# EAGLE design Line Camera Rev. A (EAGLE 9.4.0)

## Sheet 1 of 2
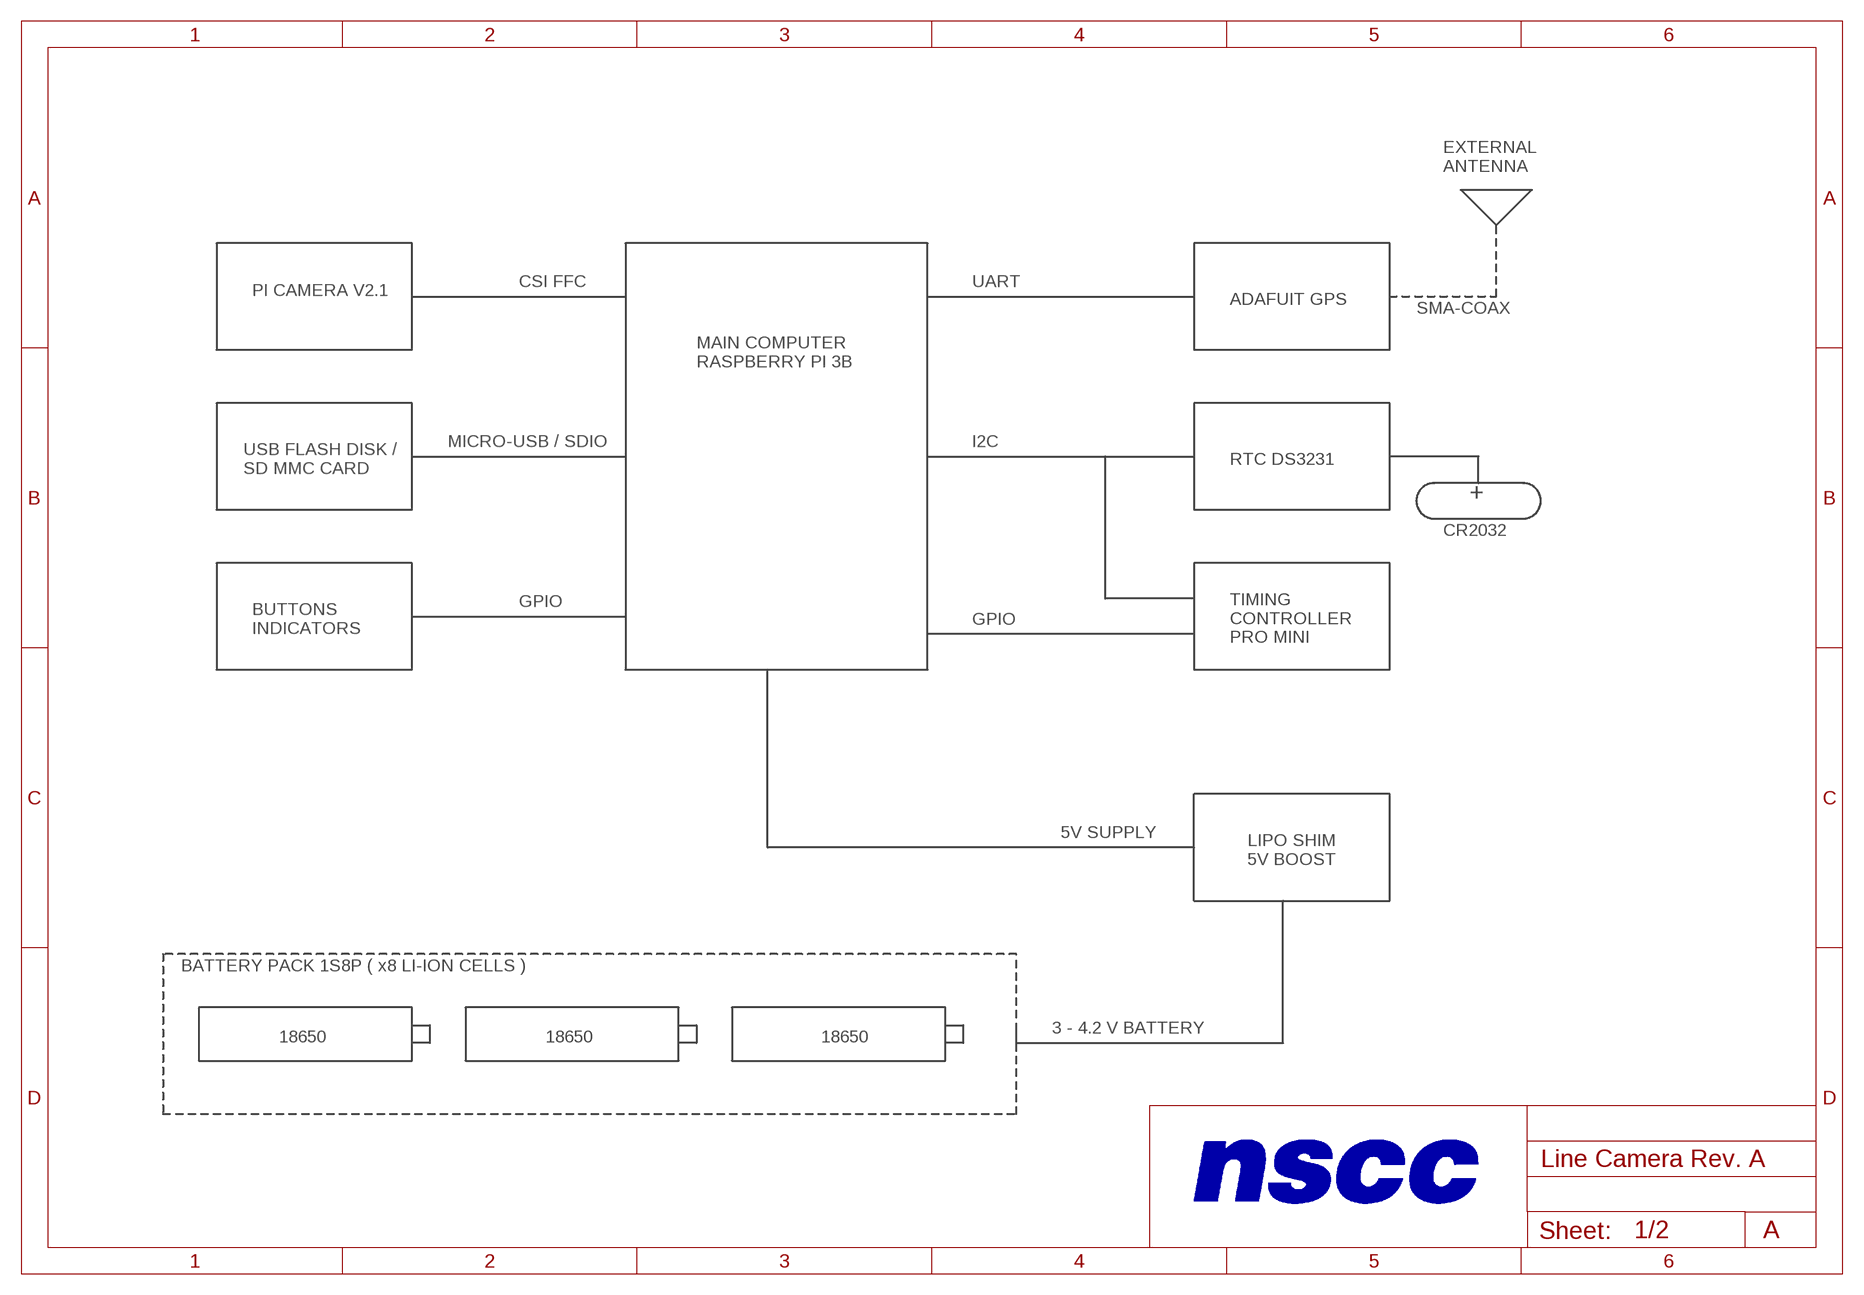
[diagram p0: schematic, sheet 1]

### Notes on the sheet
- EXTERNAL 
  ANTENNA
- CSI FFC | UART
- PI CAMERA V2.1
- ADAFUIT GPS
- SMA-COAX
- MAIN COMPUTER
  RASPBERRY PI 3B
- MICRO-USB / SDIO | I2C
- RTC DS3231
- USB FLASH DISK /
  SD MMC CARD
- +
- CR2032
- GPIO
- GPIO
- BUTTONS
  INDICATORS
- TIMING 
  CONTROLLER
  PRO MINI
- 5V SUPPLY
- LIPO SHIM
  5V BOOST
- BATTERY PACK 1S8P ( x8 LI-ION CELLS )
- 3 - 4.2 V BATTERY
- 18650 | 18650 | 18650
- A

## Sheet 2 of 2
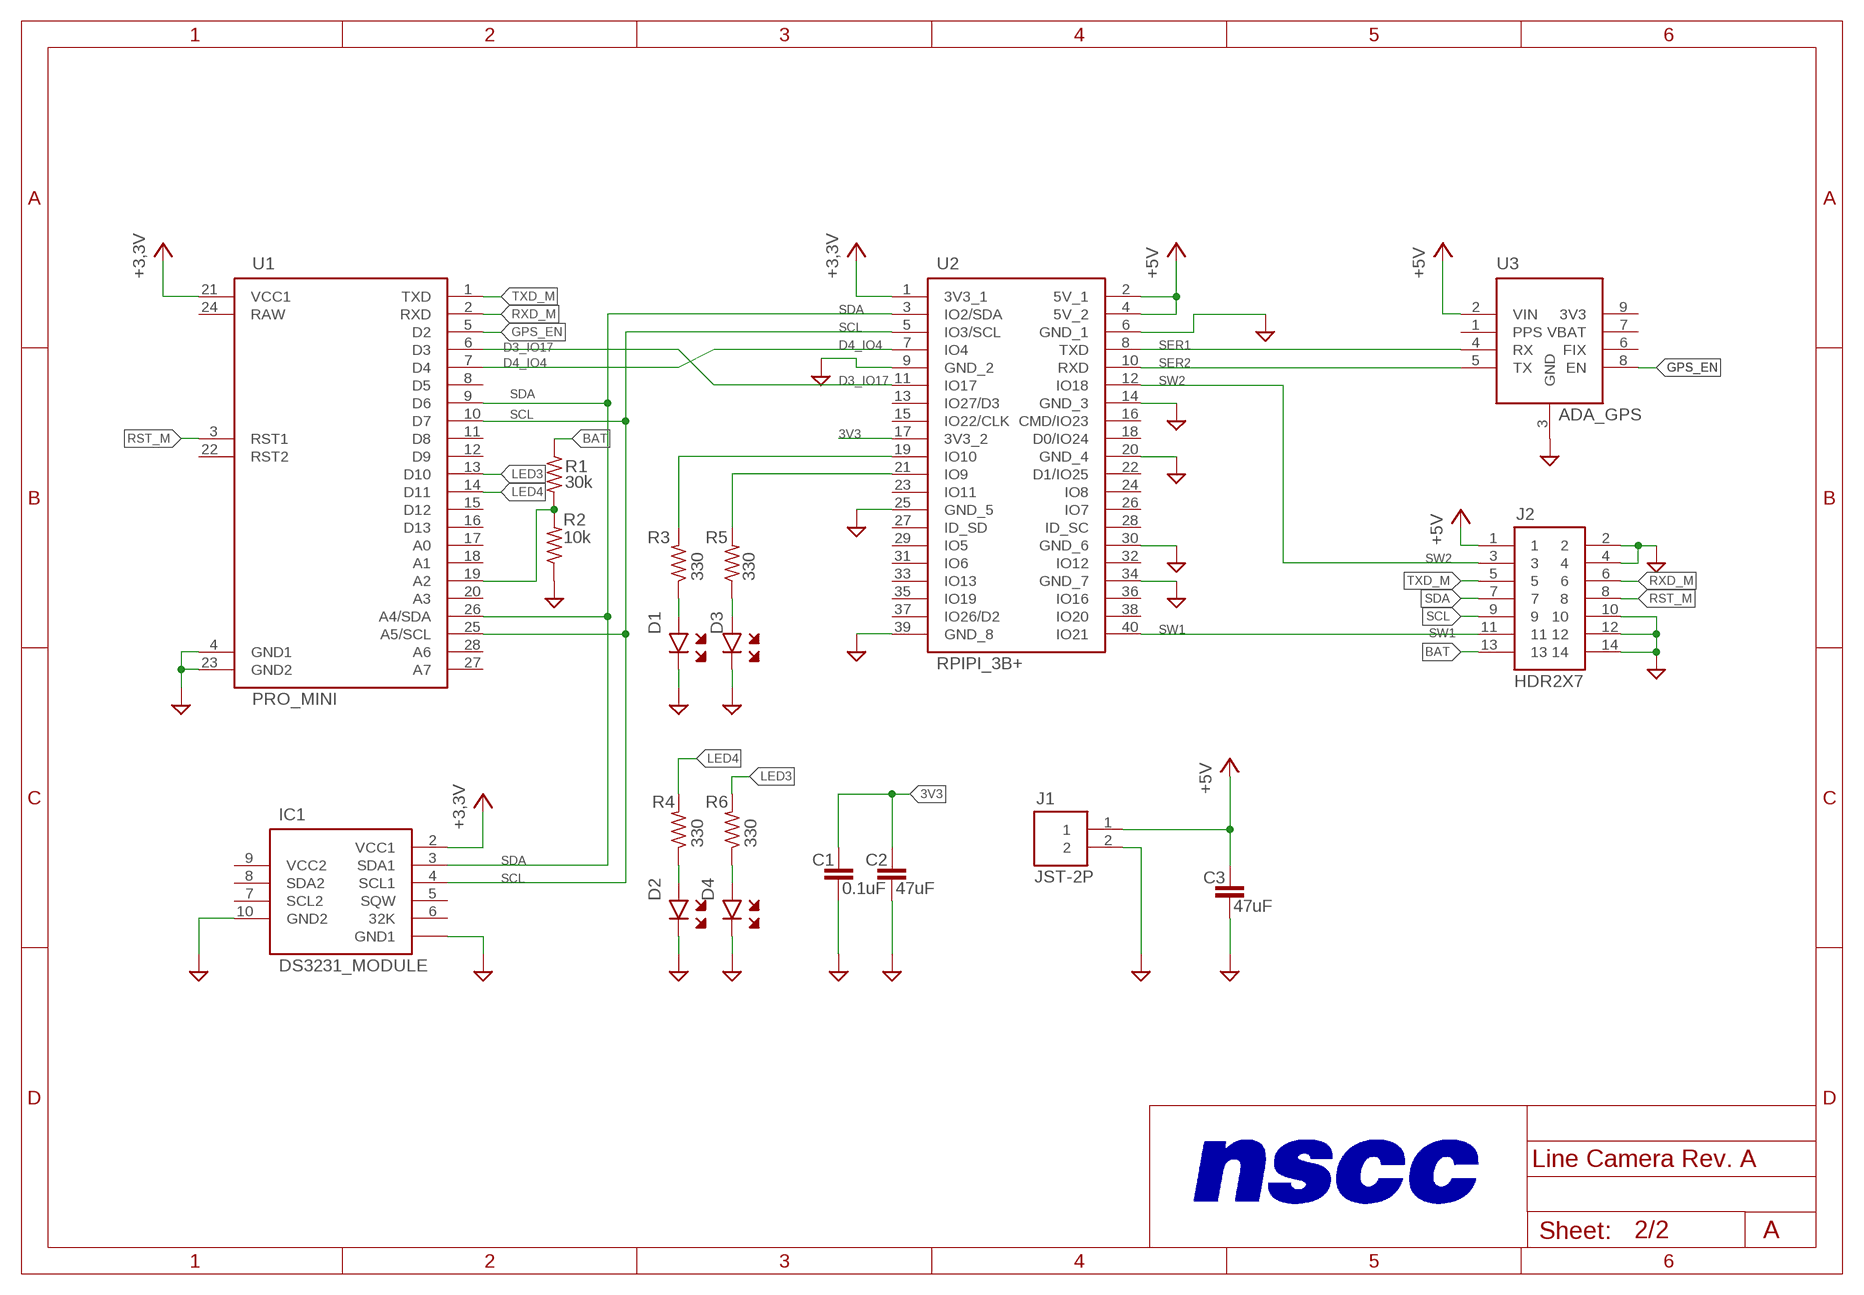
[diagram p1: schematic, sheet 2]

### Parts
C1  0.1uF  CAP_THCAP-TH-2MM  [CAPPRD254W65D300H300B]
C2  47uF  CAP_THCAP-ELECTRO-5.08  [CAPPRD508W65D1000H1100B]
C3  47uF  CAP_THCAP-ELECTRO-5.08  [CAPPRD508W65D1000H1100B]
D1  LED_THLED-2.54  [LEDRD254W60D565H860B]
D2  LED_THLED-2.54  [LEDRD254W60D565H860B]
D3  LED_THLED-2.54  [LEDRD254W60D565H860B]
D4  LED_THLED-2.54  [LEDRD254W60D565H860B]
IC1  DS3231_MODULE  [DS3231_MODULE]
J1  JST-2P  HDR1X22P2.54MM  [HDR1X2]
J2  HDR2X7  HDR2X7HDR2X7  [HDR2X7]
R1  30k  RES_THRES-D8.5  [RESAD1176W63L850D250B]
R2  10k  RES_THRES-D8.5  [RESAD1176W63L850D250B]
R3  330  RES_THRES-D8.5  [RESAD1176W63L850D250B]
R4  330  RES_THRES-D8.5  [RESAD1176W63L850D250B]
R5  330  RES_THRES-D8.5  [RESAD1176W63L850D250B]
R6  330  RES_THRES-D8.5  [RESAD1176W63L850D250B]
U1  PRO_MINI  [PRO_MINI]
U2  RPIPI_3B+  [PI_3B]
U3  ADA_GPS  ADA_ULTIMATE_GPS9P_BREAKOUT  [ADA_ULTIMATE_GPS]

### Nets
3V3: C1.1 C2.1 U2.17(3V3_2)
+3,3V: IC1.2(VCC1) U1.21(VCC1) U2.1(3V3_1)
+5V: C3.1 J1.1 J2.1 U2.2(5V_1) U2.4(5V_2) U3.2(VIN)
BAT: J2.13 R1.1
BAT_IN: R1.2 R2.2 U1.19(A2)
D3_IO17: U1.6(D3) U2.11(IO17)
D4_IO4: U1.7(D4) U2.7(IO4)
GND: C1.2 C2.2 C3.2 D1.2 D2.2 D3.2 D4.2 IC1.1(GND1) IC1.10(GND2) J1.2 J2.2 J2.4 J2.10 J2.12 J2.14 R2.1 U1.4(GND1) U1.23(GND2) U2.6(GND_1) U2.9(GND_2) U2.14(GND_3) U2.20(GND_4) U2.25(GND_5) U2.30(GND_6) U2.34(GND_7) U2.39(GND_8) U3.3(GND)
GPS_EN: U1.5(D2) U3.8(EN)
LED1: R3.2 U2.19(IO10)
LED2: R5.2 U2.21(IO9)
LED3: R6.2 U1.13(D10)
LED4: R4.2 U1.14(D11)
N$1: D4.1 R6.1
N$10: D1.1 R3.1
N$11: D3.1 R5.1
N$15: D2.1 R4.1
RST_M: J2.8 U1.3(RST1)
RXD_M: J2.6 U1.2(RXD)
SCL: IC1.4(SCL1) J2.9 U1.10(D7) U1.25(A5/SCL) U2.5(IO3/SCL)
SDA: IC1.3(SDA1) J2.7 U1.9(D6) U1.26(A4/SDA) U2.3(IO2/SDA)
SER1: U2.8(TXD) U3.4(RX)
SER2: U2.10(RXD) U3.5(TX)
SW1: J2.11 U2.40(IO21)
SW2: J2.3 U2.12(IO18)
TXD_M: J2.5 U1.1(TXD)
Unconnected: IC1.5(SQW) IC1.6(32K) IC1.7(SCL2) IC1.8(SDA2) IC1.9(VCC2) U1.8(D5) U1.11(D8) U1.12(D9) U1.15(D12) U1.16(D13) U1.17(A0) U1.18(A1) U1.20(A3) U1.22(RST2) U1.24(RAW) U1.27(A7) U1.28(A6) U2.13(IO27/D3) U2.15(IO22/CLK) U2.16(CMD/IO23) U2.18(D0/IO24) U2.22(D1/IO25) U2.23(IO11) U2.24(IO8) U2.26(IO7) U2.27(ID_SD) U2.28(ID_SC) U2.29(IO5) U2.31(IO6) U2.32(IO12) U2.33(IO13) U2.35(IO19) U2.36(IO16) U2.37(IO26/D2) U2.38(IO20) U3.1(PPS) U3.6(FIX) U3.7(VBAT) U3.9(3V3)

### Notes on the sheet
- A

## Library data of the parts
C1-C3 = Underwater-Camera-v2.0:CAP_TH: Capacitor Electro. TH
D1-D4 = Underwater-Camera-v2.0:LED_TH: TH LED - large
IC1 = Underwater-Camera-v2.0:DS3231_MODULE: DS3231 RTC Breakout Module
J1 = Underwater-Camera-v2.0:HDR1X2: Header 2pin 2.54mm pitch
J2 = Underwater-Camera-v2.0:HDR2X7
R1-R6 = Underwater-Camera-v2.0:RES_TH: Resistor TH
U1 = Underwater-Camera-v2.0:PRO_MINI: Arduino Pro Mini from SparkFun 3.3V
U2 = Underwater-Camera-v2.0:RPI: Pi Header with different package variations
U3 = Underwater-Camera-v2.0:ADA_ULTIMATE_GPS: Ultimate GPS from Adafruit - Breakout https://learn.adafruit.com/adafruit-ultimate-gps

## Board
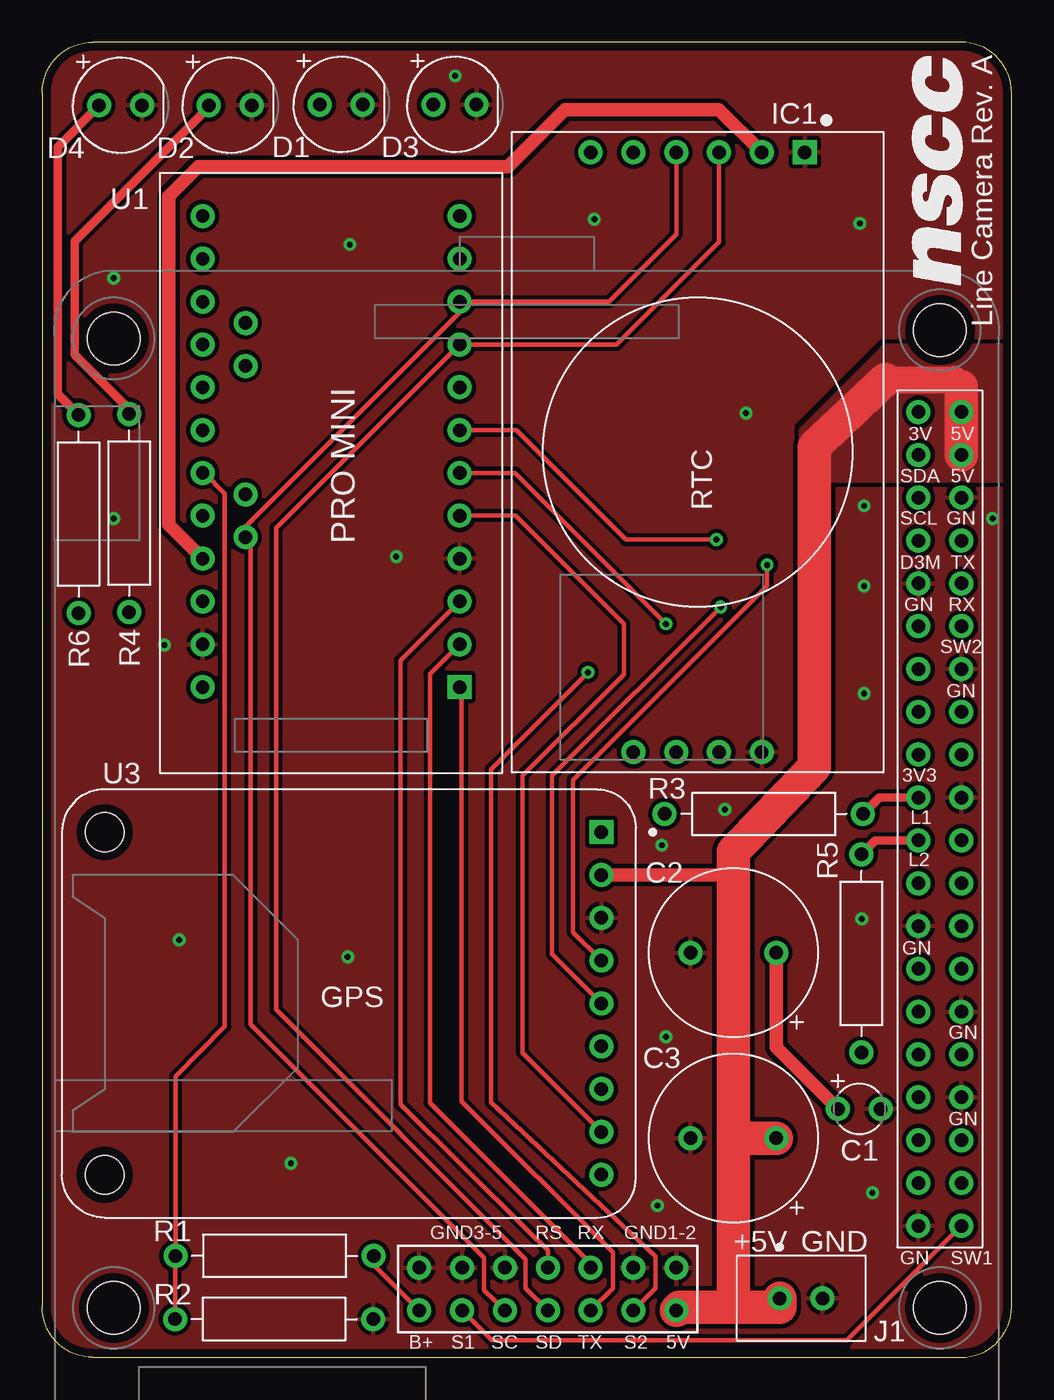
[diagram p2: board, top side]
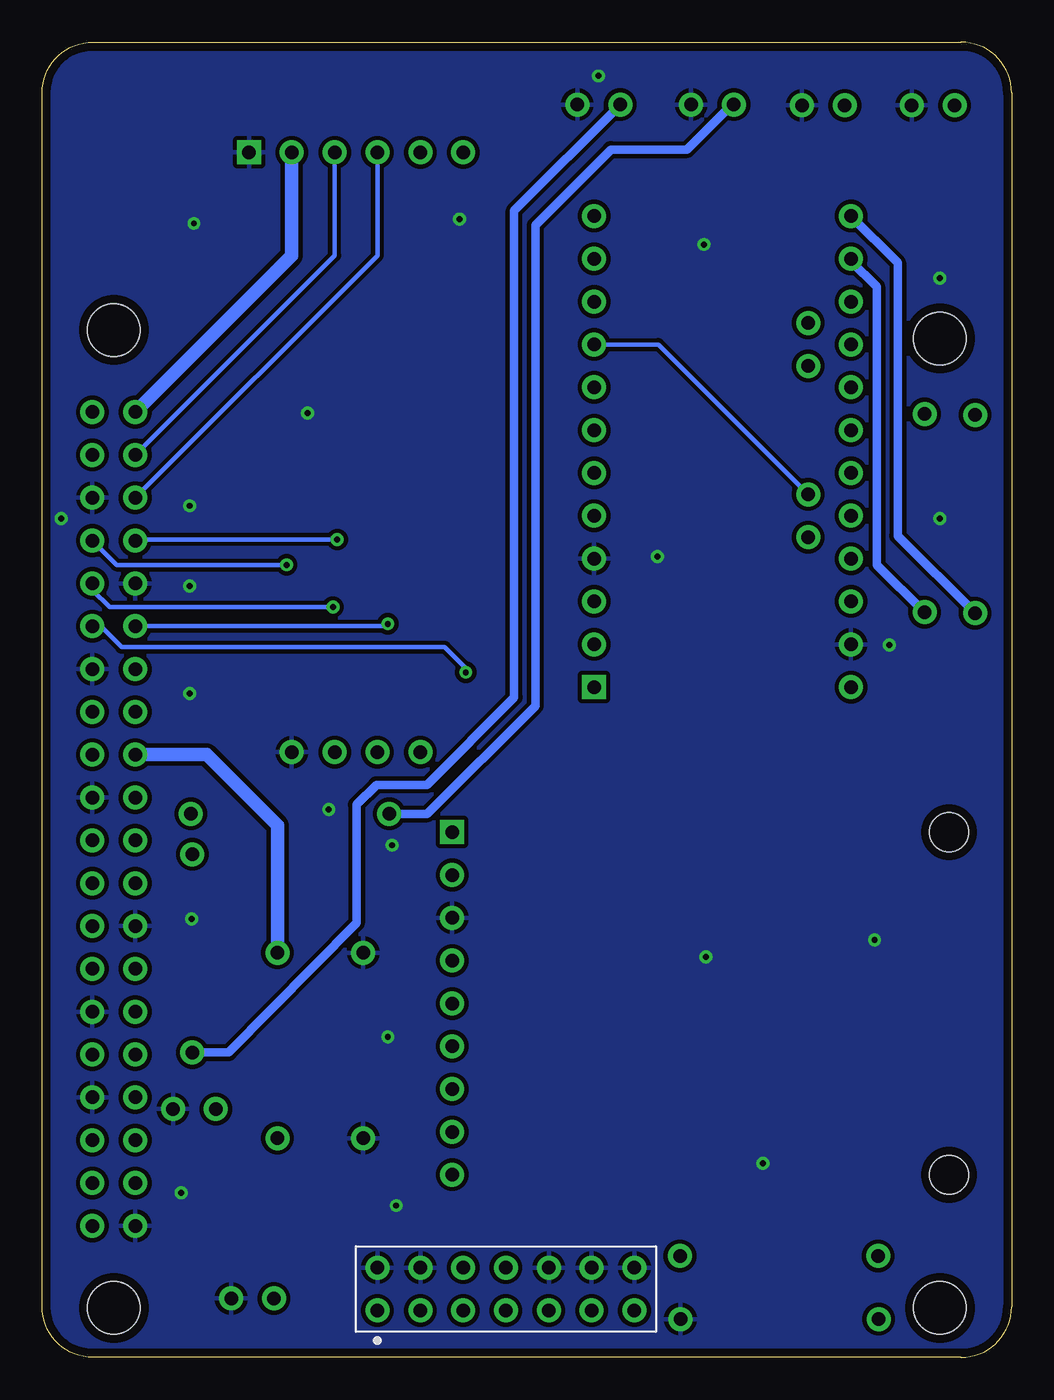
[diagram p3: board, bottom side, seen from below]

Size 57.5 x 78 mm. Coordinates in mm from the lower left corner, seen from the top.
Outline: 3,0 54.5,0 arc90 57.5,3 57.5,75 arc90 54.5,78 3,78 arc90 0,75 0,3 arc90 3,0
Copper layers (1*16): Top 0.035mm / dielectric 1.5mm / Bottom 0.035mm
Design rules "default *": minimum track width 10mil, minimum drill 10mil, track to track 10mil, track to pad 10mil, pad to pad 10mil, via to via 10mil, smd to smd 10mil, copper to edge 20mil, drill to drill 10mil, minimum pad ring 10mil, minimum via ring 8mil, stop-mask expansion 4mil, vias tented up to drill 0mil, thermal gap 10mil

### Footprints (pad centres in the part's own frame; a part is rotated, then mirrored left to right if it is on the bottom)
CAPPRD254W65D300H300B = drill 0.8 pad 1.422: 1 -1.27,0; 2 1.27,0
CAPPRD508W65D1000H1100B = drill 0.8 pad 1.422: 1 -2.54,0; 2 2.54,0
LEDRD254W60D565H860B = drill 0.8 pad 1.422: 1 -1.27,0; 2 1.27,0
DS3231_MODULE = drill 0.8 pad 1.422 square: 1 -6.35,-17.78 | drill 0.8 pad 1.422: 2 -3.81,-17.78; 3 -1.27,-17.78; 4 1.27,-17.78; 5 3.81,-17.78; 6 6.35,-17.78; 7 3.81,17.78; 8 1.27,17.78; 9 -1.27,17.78; 10 -3.81,17.78
HDR1X2 = drill 0.8 pad 1.422: 1 0,0; 2 2.54,0
HDR2X7 = drill 0.8 pad 1.422: 1 0,0; 2 0,2.54; 3 2.54,0; 4 2.54,2.54; 5 5.08,0; 6 5.08,2.54; 7 7.62,0; 8 7.62,2.54; 9 10.16,0; 10 10.16,2.54; 11 12.7,0; 12 12.7,2.54; 13 15.24,0; 14 15.24,2.54
RESAD1176W63L850D250B = drill 0.8 pad 1.422: 1 -5.88,0; 2 5.88,0
PRO_MINI = drill 0.8 pad 1.422 square: 1 -7.62,15.24 | drill 0.8 pad 1.422: 2 -7.62,12.7; 3 -7.62,10.16; 4 -7.62,7.62; 5 -7.62,5.08; 6 -7.62,2.54; 7 -7.62,0; 8 -7.62,-2.54; 9 -7.62,-5.08; 10 -7.62,-7.62; 11 -7.62,-10.16; 12 -7.62,-12.7; 13 7.62,-12.7; 14 7.62,-10.16; 15 7.62,-7.62; 16 7.62,-5.08; 17 7.62,-2.54; 18 7.62,0; 19 7.62,2.54; 20 7.62,5.08; 21 7.62,7.62; 22 7.62,10.16; 23 7.62,12.7; 24 7.62,15.24; 25 5.08,6.35; 26 5.08,3.81; 27 5.08,-3.81; 28 5.08,-6.35
PI_3B = drill 0.8 pad 1.422: 1 51.23,76.63; 2 53.77,76.63; 3 51.23,74.09; 4 53.77,74.09; 5 51.23,71.55; 6 53.77,71.55; 7 51.23,69.01; 8 53.77,69.01; 9 51.23,66.47; 10 53.77,66.47; 11 51.23,63.93; 12 53.77,63.93; 13 51.23,61.39; 14 53.77,61.39; 15 51.23,58.85; 16 53.77,58.85; 17 51.23,56.31; 18 53.77,56.31; 19 51.23,53.77; 20 53.77,53.77; 21 51.23,51.23; 22 53.77,51.23; 23 51.23,48.69; 24 53.77,48.69; 25 51.23,46.15; 26 53.77,46.15; 27 51.23,43.61; 28 53.77,43.61; 29 51.23,41.07; 30 53.77,41.07; 31 51.23,38.53; 32 53.77,38.53; 33 51.23,35.99; 34 53.77,35.99; 35 51.23,33.45; 36 53.77,33.45; 37 51.23,30.91; 38 53.77,30.91; 39 51.23,28.37; 40 53.77,28.37 | hole 3.1: 52.5,81.5; 52.5,23.5; 3.5,81; 3.5,23.5
ADA_ULTIMATE_GPS = drill 0.8 pad 1.422 square: 1 10.16,-15.494 | drill 0.8 pad 1.422: 2 7.62,-15.494; 3 5.08,-15.494; 4 2.54,-15.494; 5 0,-15.494; 6 -2.54,-15.494; 7 -5.08,-15.494; 8 -7.62,-15.494; 9 -10.16,-15.494 | hole 2.286: -10.16,13.97; 10.16,13.97

### Placement (x,y rotation side)
C1  48.47,14.73 0 top
C2  41,24 180 top
C3  41,13 180 top
D1  17.74,74.3 0 top
D2  11.16,74.25 0 top
D3  24.48,74.3 0 top
D4  4.65,74.25 0 top
IC1  38.88,53.68 180 top
J1  43.75,3.5 0 top
J2  37.61,2.78 0 bottom
R1  13.79,6.02 180 top
R2  13.76,2.27 180 top
R3  42.8,32.23 0 top
R4  5.16,50.07 270 top
R5  48.59,23.96 90 top
R6  2.16,50.01 270 top
U1  17.14,54.99 180 top
U2  0.75,-20.57 0 top
U3  17.68,20.99 90 top

### Tracks (layer width: path | path; a pad name or v marks a point on that pad's centre or on a via)
3V3
  Top 0.813: C1.1 43.54,18.39 C2.1
  Bottom 0.813: U2.17 47.74,35.74 43.54,31.54 C2.1
+3,3V
  Top 0.813: U1.21 7.5,49.39 7.5,68.88 9.25,70.62 27.62,70.62 31,74 40.15,74 IC1.2
  Bottom 0.813: U2.1 42.69,65.35 IC1.2
+5V
  Top 0.813: U3.2 40.61,28.61 41,29
  Top 1.6: 50,58 54.08,58 54.52,57.56
  Top 2: 50,58 45.8,54 45.8,35 41,30 41,29 41,13 | J2.1 37.79,2.96 41,2.96 | 41,2.96 43.75,2.96 J1.1 | C3.1 41,13 | 54.52,57.56 U2.2 U2.4 | 41,13 41,2.96
  pour Top (isolate 0.254, no thermals): 57,52 45,52 45,55 50,60 57,60
BAT
  Top 0.254: J2.13 19.67,5.48 R1.1
BAT_IN
  Top 0.254: R2.2 7.88,5.99 R1.2 7.91,16.66 10.83,19.62 10.83,51.22 9.64,52.45 U1.19
D3_IO17  (via drill 0.35)
  Top 0.254: v37,43.5 28.05,52.45 U1.6
  Bottom 0.254: U2.11 37.14,43.36 v37,43.5
D4_IO4  (via drill 0.35)
  Top 0.254: U1.7 28.14,54.99 34.62,48.5 v40,48.5
  Bottom 0.254: v40,48.5 51.92,48.5 U2.7
GND  (via drill 0.35)
  other vias: 48.75,45.75 49.25,9.75 36.5,9 37,19 48.62,26 36.75,30.38 40.5,32.5 14.75,11.5 18.12,23.75 7.25,42.25 4.25,49.75 21,47.5 4.25,64 32.75,67.5 18.25,66 41.75,56 56.38,49.75 48.5,67.25 48.75,50.5 48.75,39.38 8.12,24.75 24.5,76
  pour Bottom (isolate 0.254, rank 6): 0,0 0,78 58,78 58,0
  pour Top (isolate 0.254, rank 6): 0,0 58,0 58,78 0,78
GPS_EN
  Top 0.254: U3.8 28.5,18.04 28.5,34.5 34.5,40.5 34.5,43.5 28.09,49.91 U1.5
LED1
  Top 0.508: R3.2 49.65,33.2 U2.19
LED2
  Top 0.508: R5.2 49.41,30.66 U2.21
LED3
  Bottom 0.508: U1.13 6.75,64.92 6.75,48.72 R6.2
LED4
  Bottom 0.508: U1.14 9.52,65.02 8,63.5 8,47 5.19,44.19 R4.2
N$1
  Top 0.508: D4.1 0.91,71.78 0.91,57.14 R6.1
N$10
  Bottom 0.508: R3.1 34.67,32.23 28.25,38.64 28.25,67.14 23.77,71.62 19.25,71.62 16.57,74.3 D1.1
N$11
  Bottom 0.508: R5.1 46.43,18.08 38.85,25.75 38.85,32.78 37.68,33.95 34.68,33.95 29.5,39.14 29.5,68 D3.1
N$15
  Top 0.508: R4.1 5.16,56.25 1.94,59.47 1.94,66.19 9.89,74.14 D2.1
RST_M
  Top 0.254: U1.3 21.25,41.32 21.25,14.99 28.82,7.51 29.99,6.34 J2.8
RXD_M
  Top 0.254: U1.2 23,40.53 23,15.1 32.53,5.57 J2.6
SCL
  Top 0.254: IC1.4 37.61,66.61 33.61,62.61 U1.10 24.76,61.96 12.06,49.26 U1.25 12.37,48.33 12.37,19.76 26.2,5.89 26.2,3.98 J2.9
  Bottom 0.254: U2.5 37.61,65.35 IC1.4
SDA
  Top 0.254: IC1.3 40.15,66.15 34.07,60.07 U1.9 13.88,49.19 13.88,20.62 28.68,5.82 28.68,4.09 J2.7
  Bottom 0.254: U2.3 40.15,65.35 IC1.3 | U1.9 20.95,60.07 U1.26
SER1  (via drill 0.35)
  Top 0.254: v43,47 43,45.75 31.5,34.25 31.5,25.2 U3.4
  Bottom 0.254: U2.8 53.08,47 v43,47
SER2  (via drill 0.35)
  Top 0.254: v40.25,44.5 30.25,34.5 30.25,23.91 U3.5
  Bottom 0.254: U2.10 54.52,45.52 53.5,44.5 v40.25,44.5
SW1
  Top 0.254: J2.11 26.69,1 47.72,1 U2.40
SW2  (via drill 0.35)
  Top 0.254: v32.38,40.62 26.62,34.88 26.62,15.12 36.38,6 36.38,4.08 J2.3
  Bottom 0.254: U2.12 54.02,43.36 52.78,42.12 33.62,42.12 32.38,40.88 v32.38,40.62
TXD_M
  Top 0.254: U1.1 24.89,39.62 24.89,15.19 33.85,6.22 33.85,4.1 J2.5

### Text on the board
tPlace: Line Camera Rev. A | 3V | 5V | SDA | 5V | RTC | SCL | GN | D3M | TX | GN | RX | SW2 | GN | 3V3 | L1 | L2 | GN | GPS | GN | GN | GND3-5 | RS | RX | GND1-2 | +5V | GND | GN | SW1 | B+ | S1 | SC | SD | TX | S2 | 5V